# Altium schematic sheet reset.SchDoc: Test
size A4; DrawnBy: Łukasz Przeniosło; Organization: Apptimia sp. z o.o.; Address1: Wojska Polskiego 184c/4; Address2: 71-256 Szczecin; Address3: www.apptimia.com; DocumentNumber: 10; Revision: 1; SheetNumber: 10; SheetTotal: 12
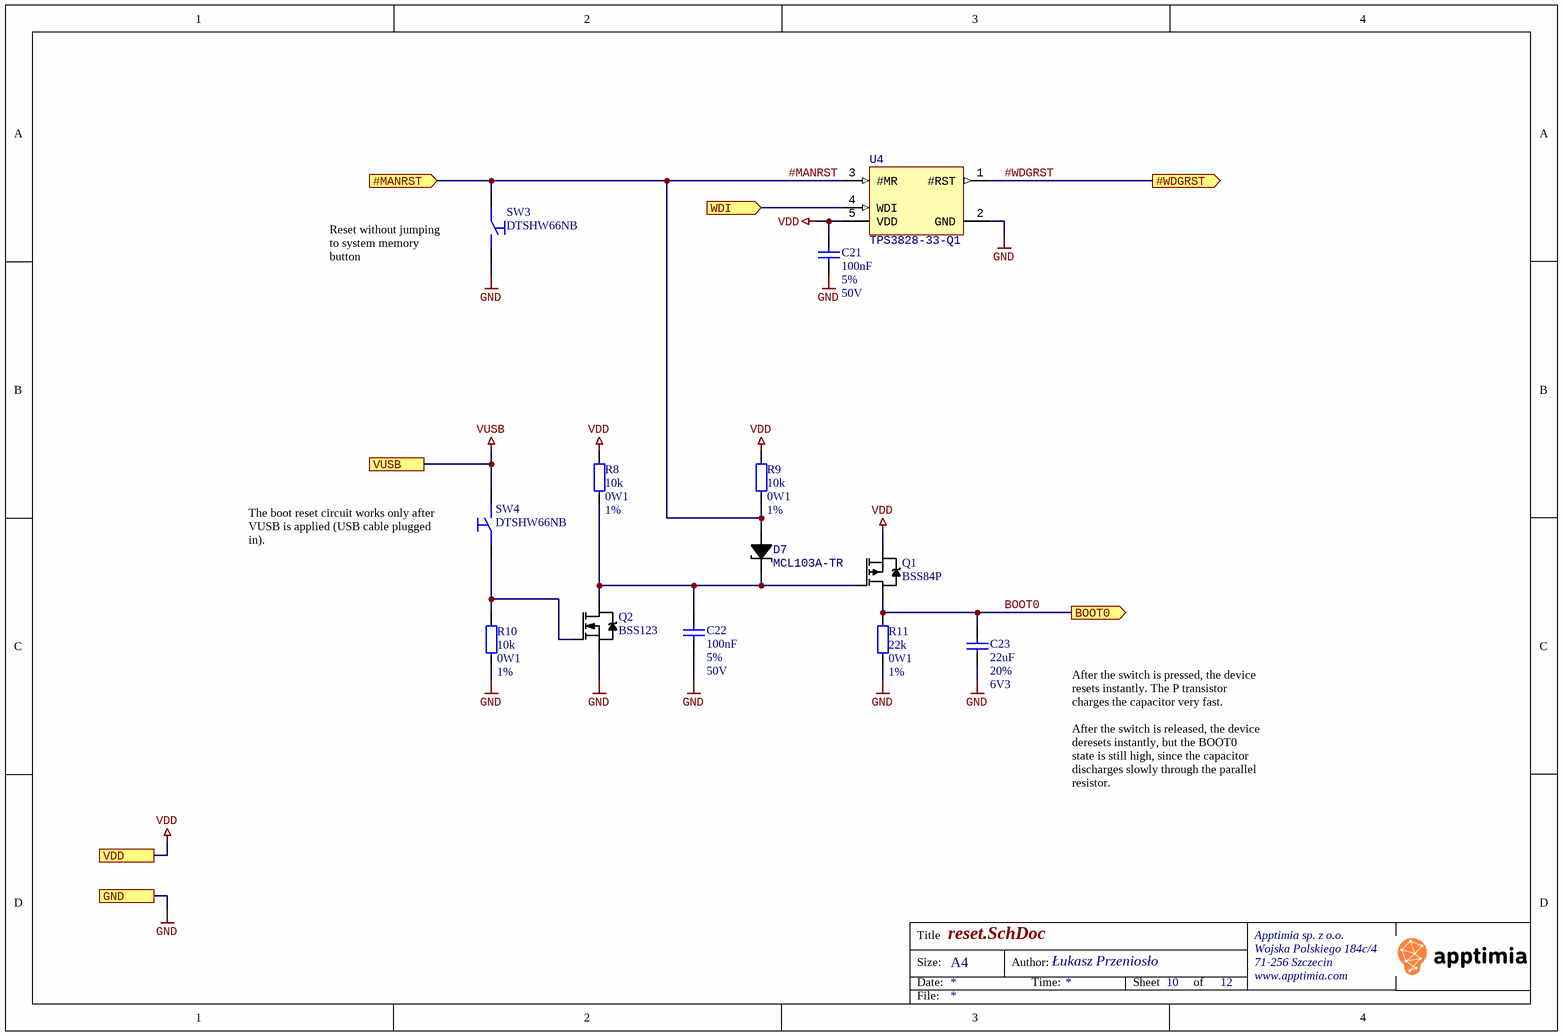
[diagram p0: reset.SchDoc]

## Parts
C21  100nF  Tolerance: 5%  Voltage: 50V  [CAPC1608N]
C22  100nF  Tolerance: 5%  Voltage: 50V  [CAPC1608N]
C23  22uF  Tolerance: 20%  Voltage: 6V3  [CAPC2012N]
D7  MCL103A-TR  [micro-melf]
Q1  BSS84P  [SOT23-3L]
Q2  BSS123  [sot23-3l]
R8  10k  Power: 0W1  Tolerance: 1%  [RESC1608N]
R9  10k  Power: 0W1  Tolerance: 1%  [RESC1608N]
R10  10k  Power: 0W1  Tolerance: 1%  [RESC1608N]
R11  22k  Power: 0W1  Tolerance: 1%  [RESC1608N]
SW3  DTSHW66NB  [FSM2J]
SW4  DTSHW66NB  [FSM2J]
U4  TPS3828-33-Q1  [SOT23-5_N]

## Ports
#MANRST (in), #WDGRST (out), BOOT0 (out), GND, VDD, VUSB, WDI (in)

## Nets
GND: C21.1 C22.2 C23.2 Q2.2(S) R10.2 R11.2 SW3.2 U4.2(GND) ; port GND
VDD: C21.2 Q1.2(S) R8.1 R9.1 U4.5(VDD) ; port VDD
VUSB: SW4.2 ; port VUSB
#MANRST: D7.2(A) R9.2 SW3.1 U4.3(#MR) ; port #MANRST
#WDGRST: U4.1(#RST) ; port #WDGRST
BOOT0: C23.1 Q1.3(D) R11.1 ; port BOOT0
WDI: U4.4(WDI) ; port WDI
NetC22_1: C22.1 D7.1(K) Q1.1(G) Q2.3(D) R8.2
NetQ2_1: Q2.1(G) R10.1 SW4.1

## Notes on the sheet
- (near SW3) Reset without jumping to system memory button
- The boot reset circuit works only after VUSB is applied (USB cable plugged in).
- After the switch is pressed, the device resets instantly. The P transistor charges the capacitor very fast.
  After the switch is released, the device deresets instantly, but the BOOT0 state is still high, since the capacitor discharges slowly through the parallel resistor.
- Title
- Size:
- Date:
- A4
- Author:
- Time:
- Sheet
- of
- File:

## Library data of the parts
C21-C23 = Capacitor
  C21 C22: Value: 100nF
  C23: Value: 22uF
D7 = MCL103: Shotky Diode; manid: MCL103A-TR
R8-R11 = Resistor
  R8-R10: Value: 10k
  R11: Value: 22k
SW3 SW4 = DTSHW66NB: SWITCH, SPNO TACT; Published: 8-Jun-2000; LatestRevisionDate: 17-Jul-2002; LatestRevisionNote: Re-released for DXP Platform.; PackageDocument: Sep-1998; PackageReference: SOT-23A; Publisher: Altium Limited; ComponentLink1Description: Manufacturer Link; ComponentLink2Description: Datasheet; Distributor: tme.pl; tme.pl: DTSHW66NB
U4 = TPS3828-xx-Q1: TPS382x-xx-Q1 Voltage Monitor With Watchdog Timer; manid: TPS3828-33-Q1
Q1 = BSS84P: manid: BSS84P
Q2 = BSS123: manid: BSS123